# EAGLE schematic rev1 (EAGLE 9.5.2)
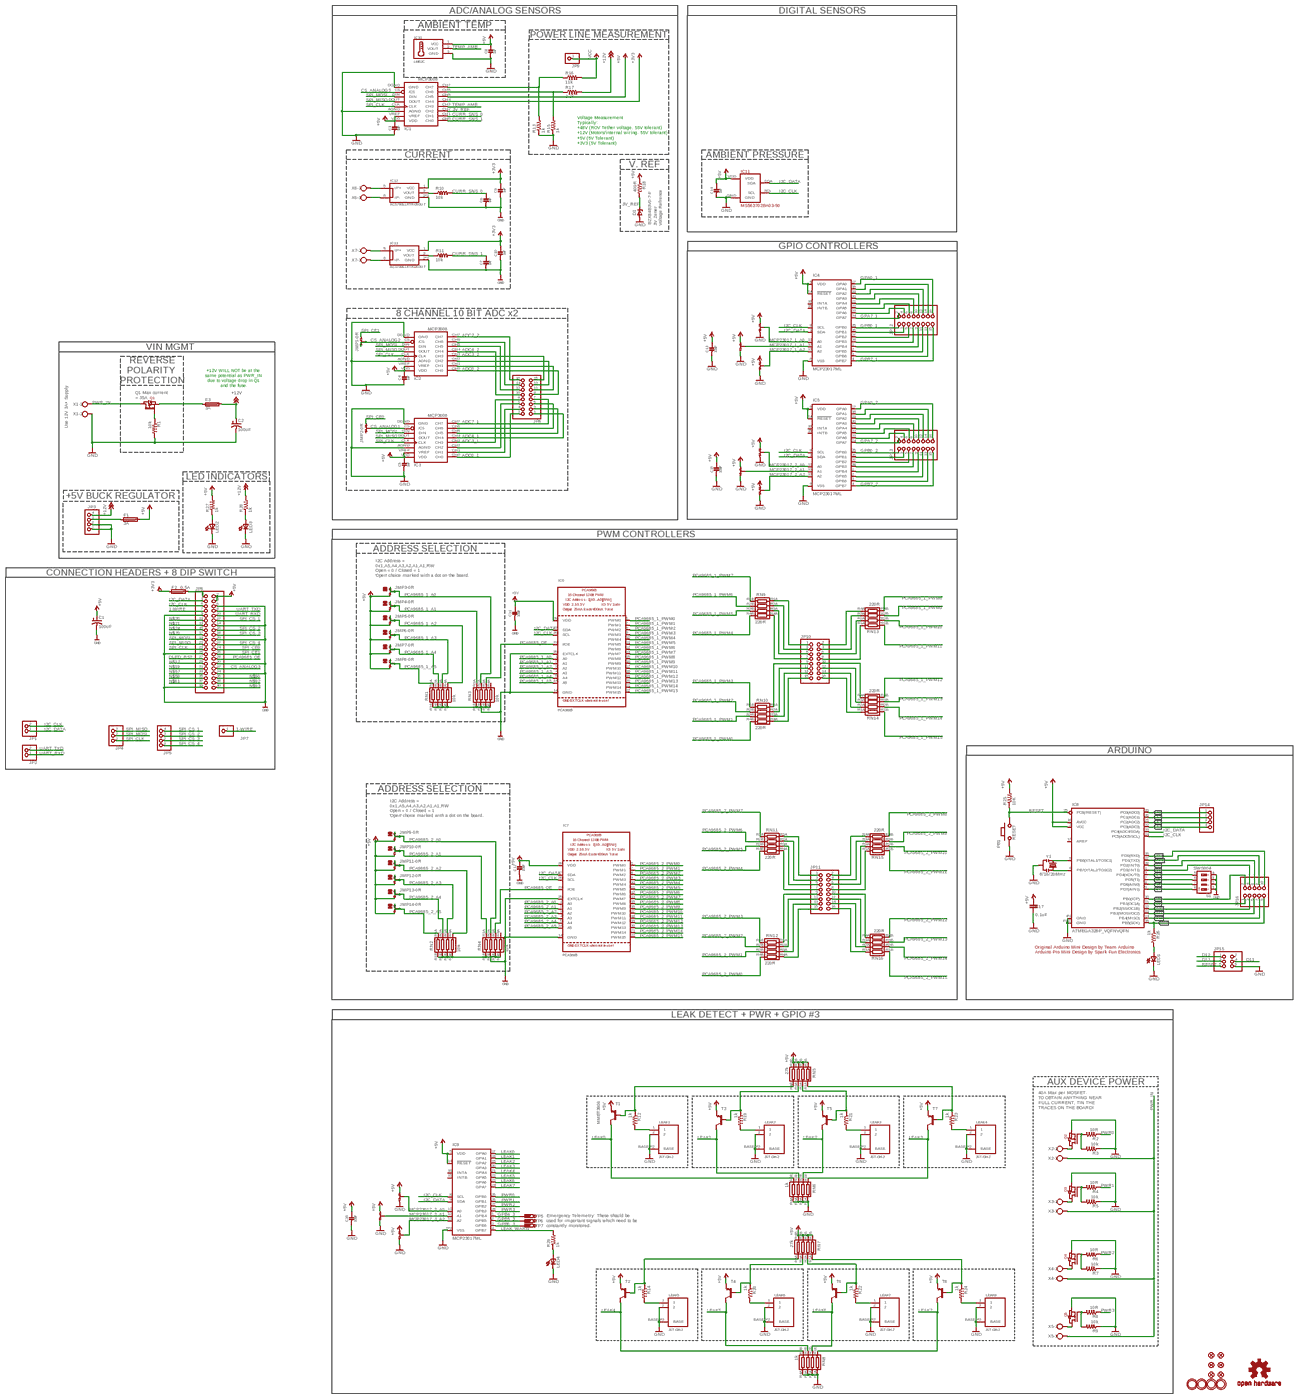
[diagram p0: schematic, sheet 1, overview]
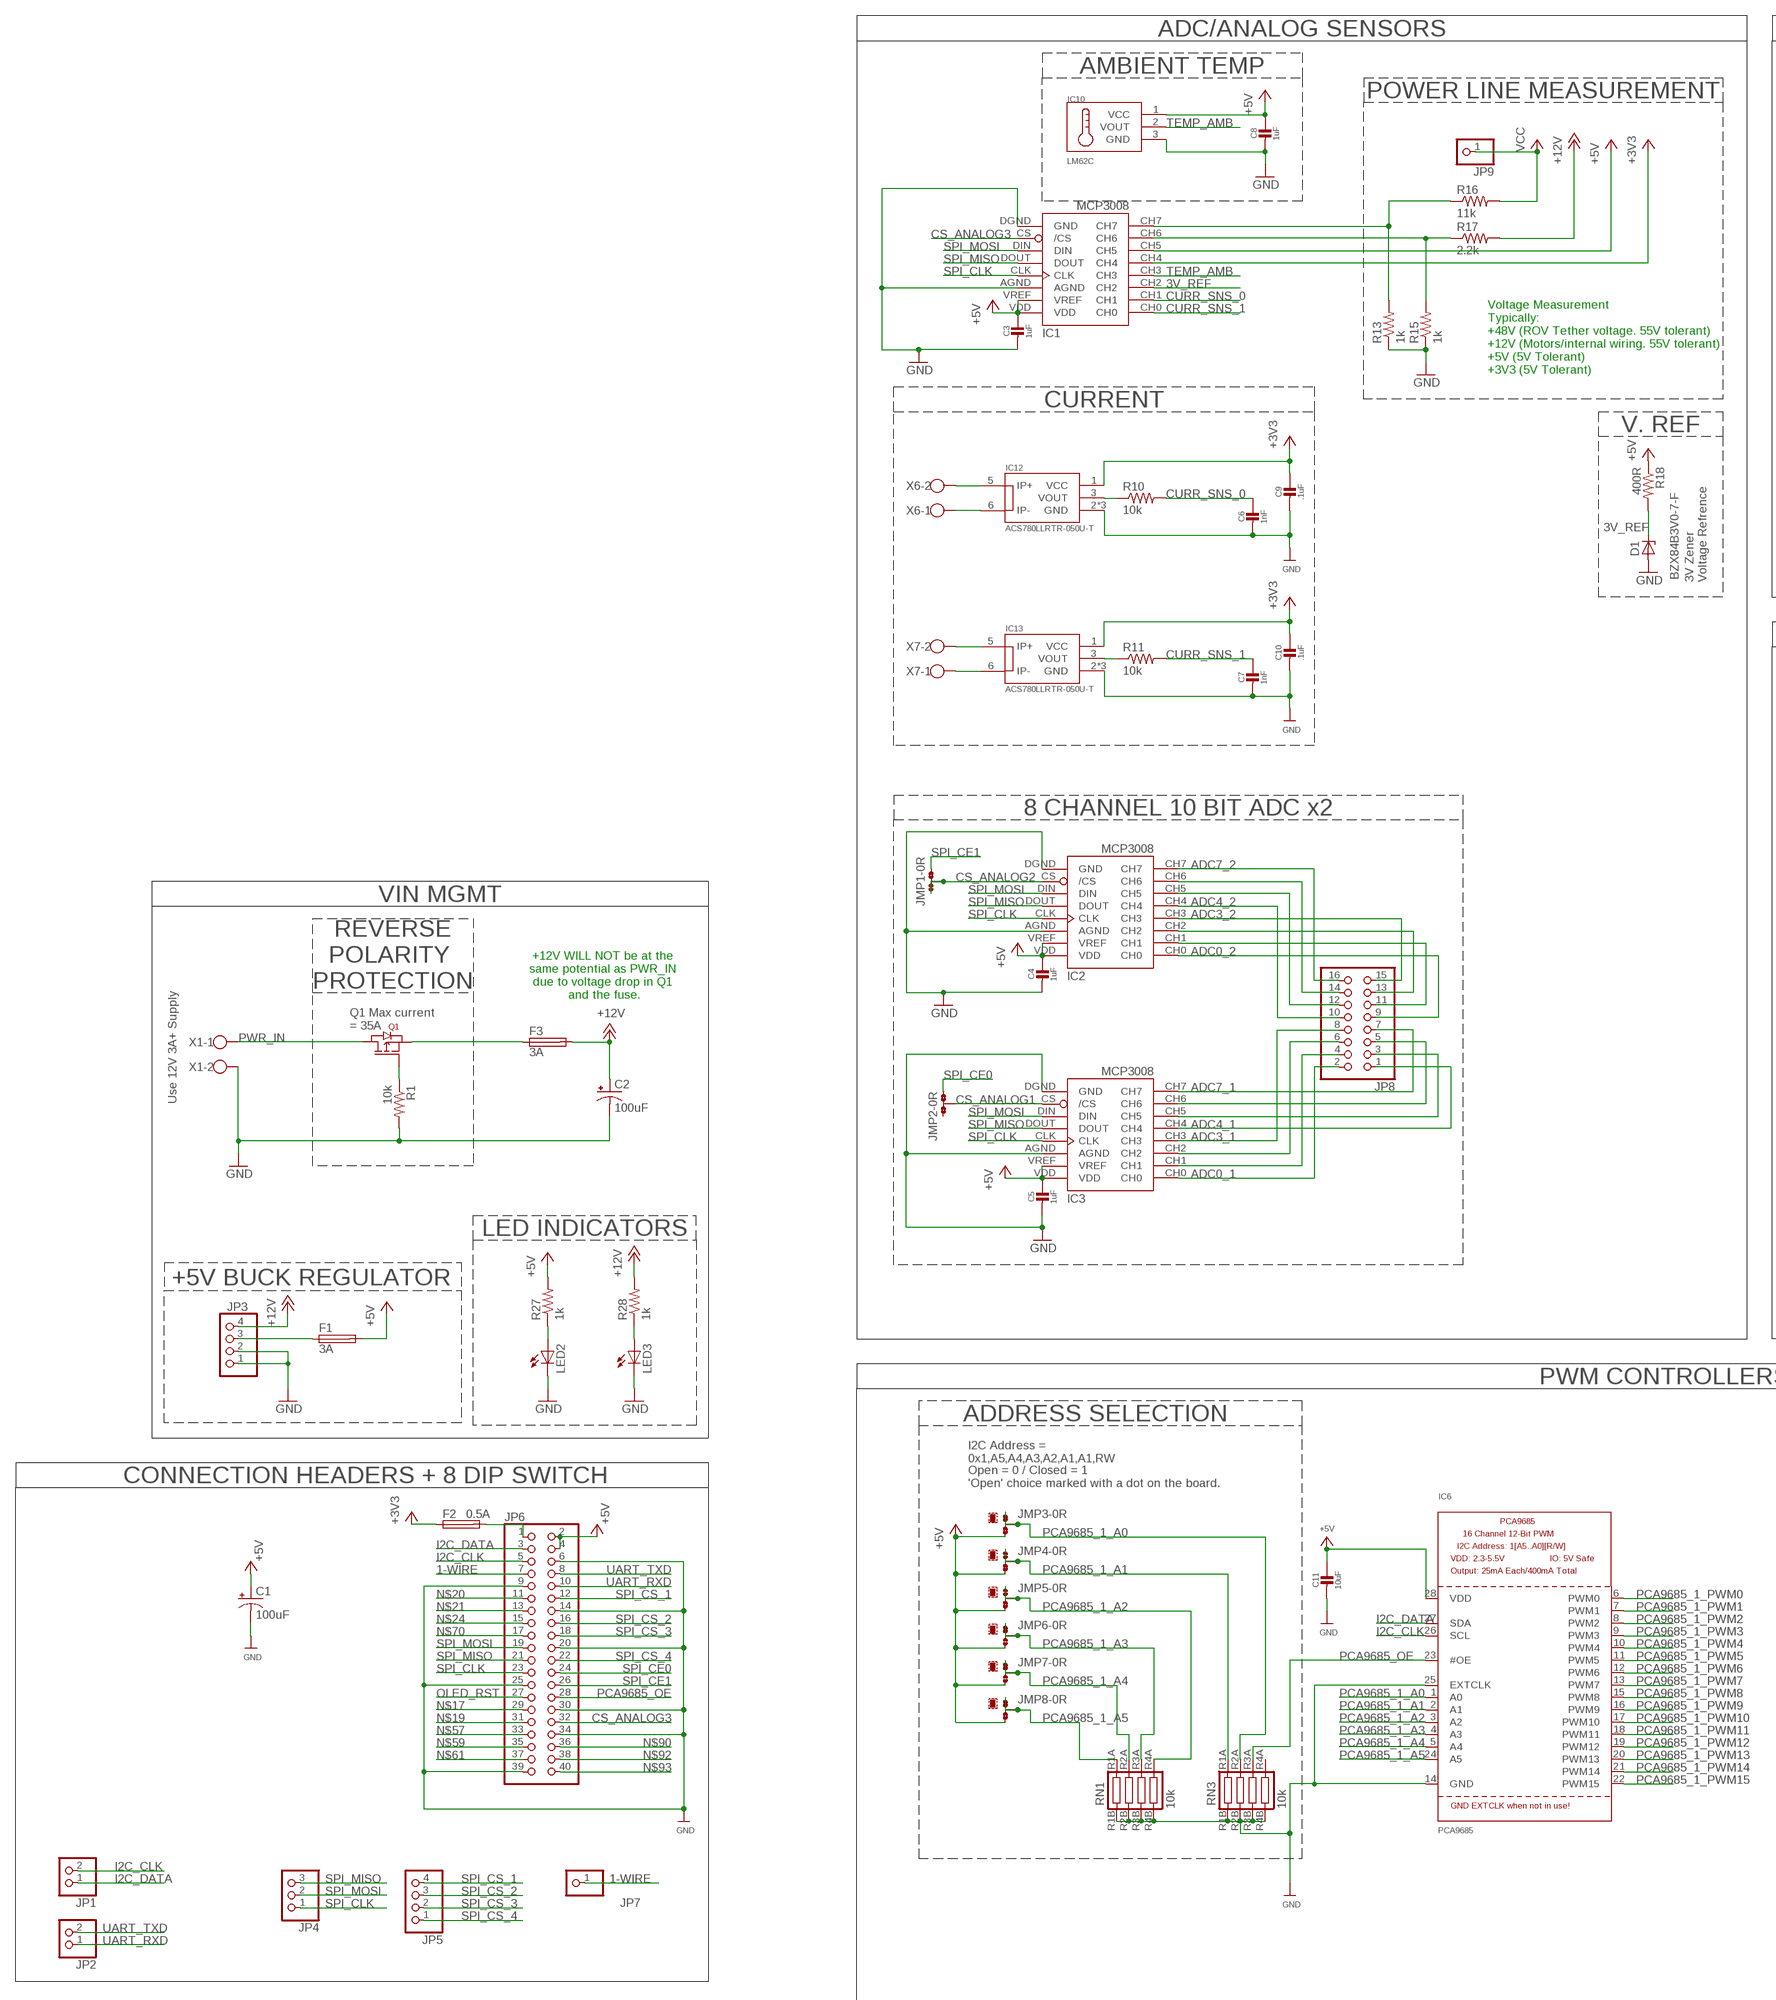
[diagram p1: schematic, sheet 1, part 1 of 4]
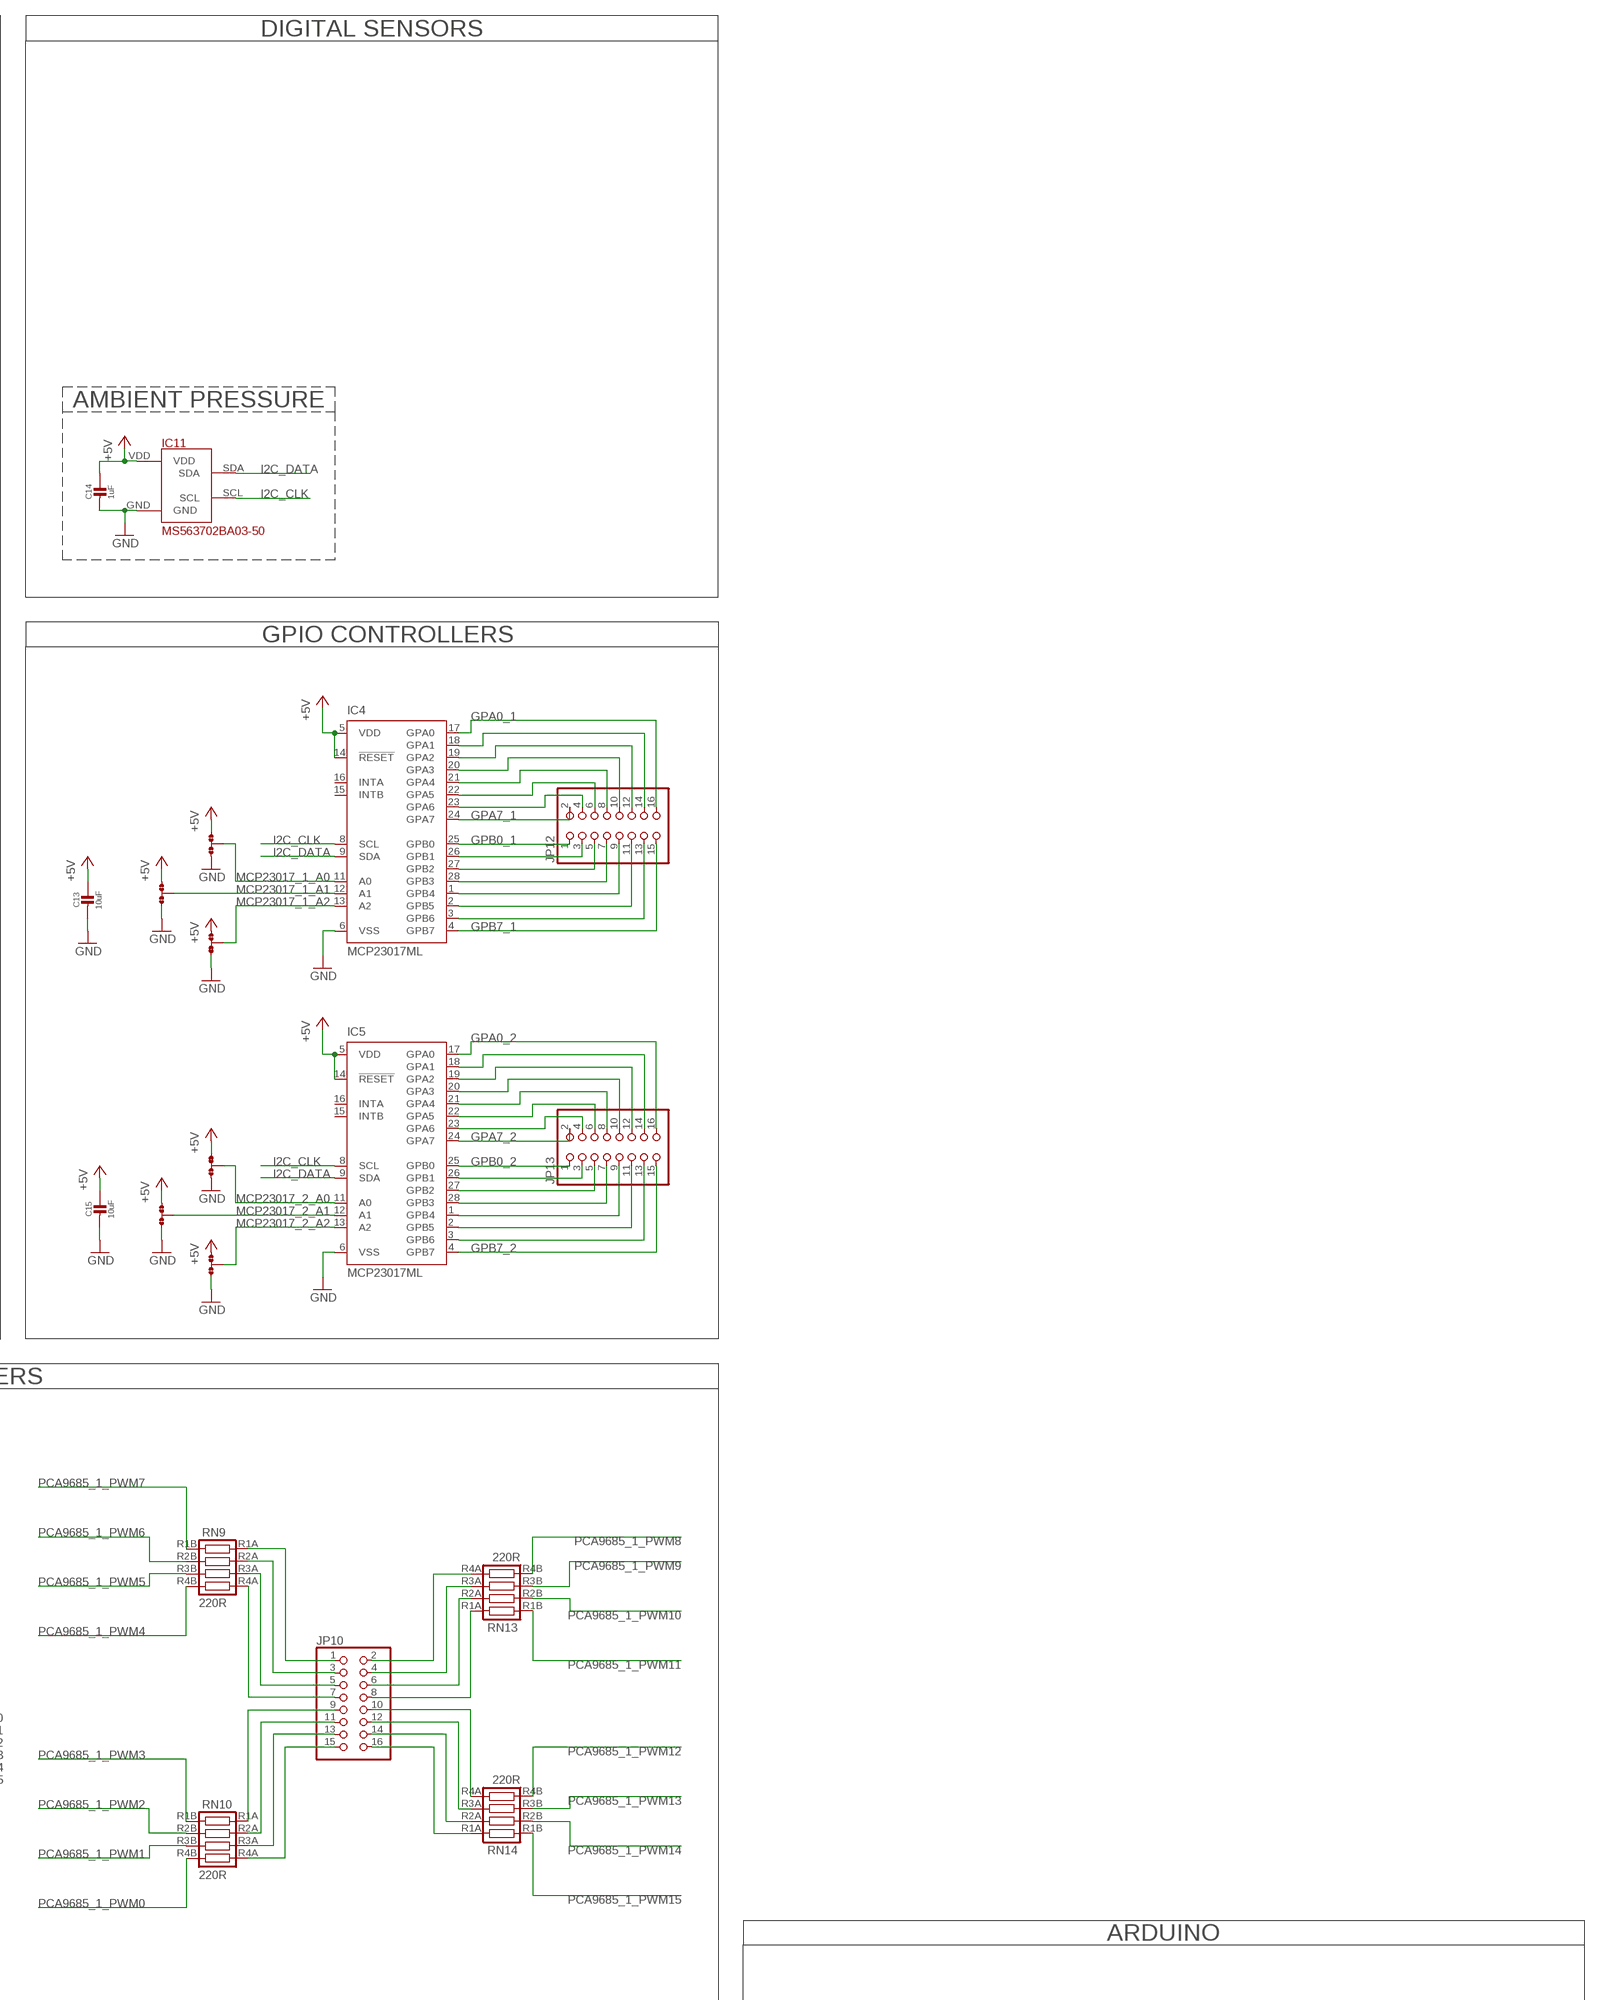
[diagram p2: schematic, sheet 1, part 2 of 4]
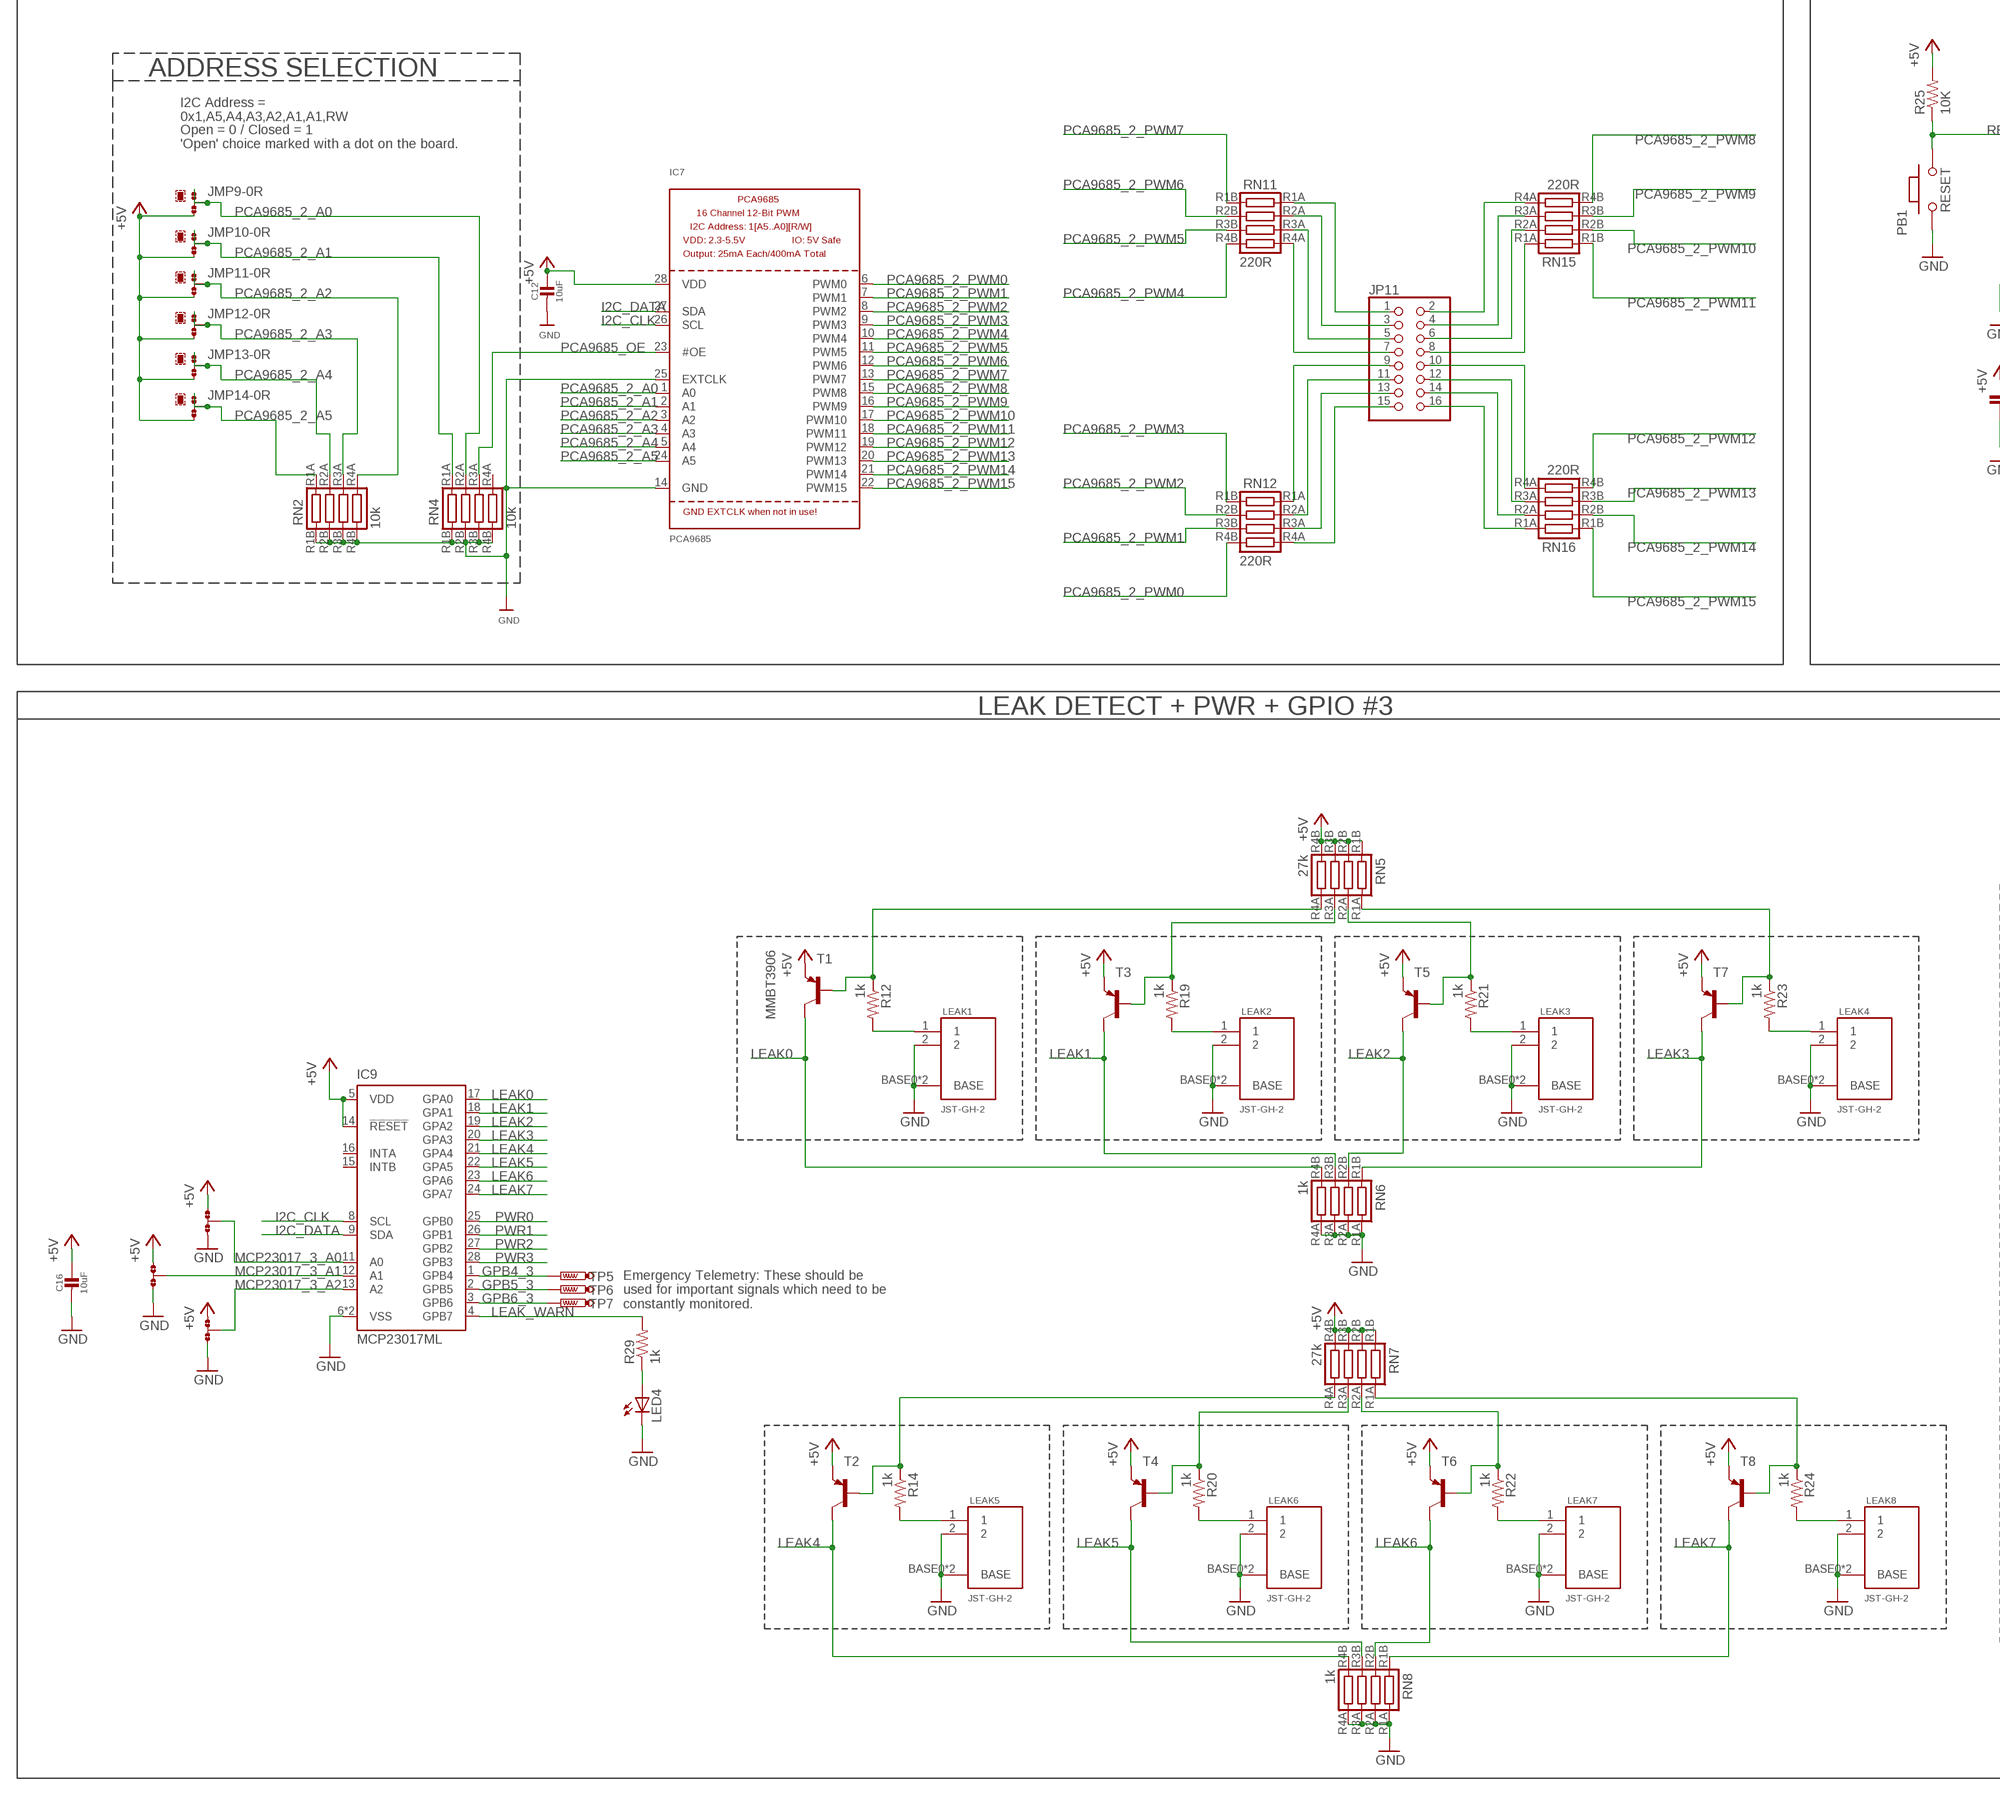
[diagram p3: schematic, sheet 1, part 3 of 4]
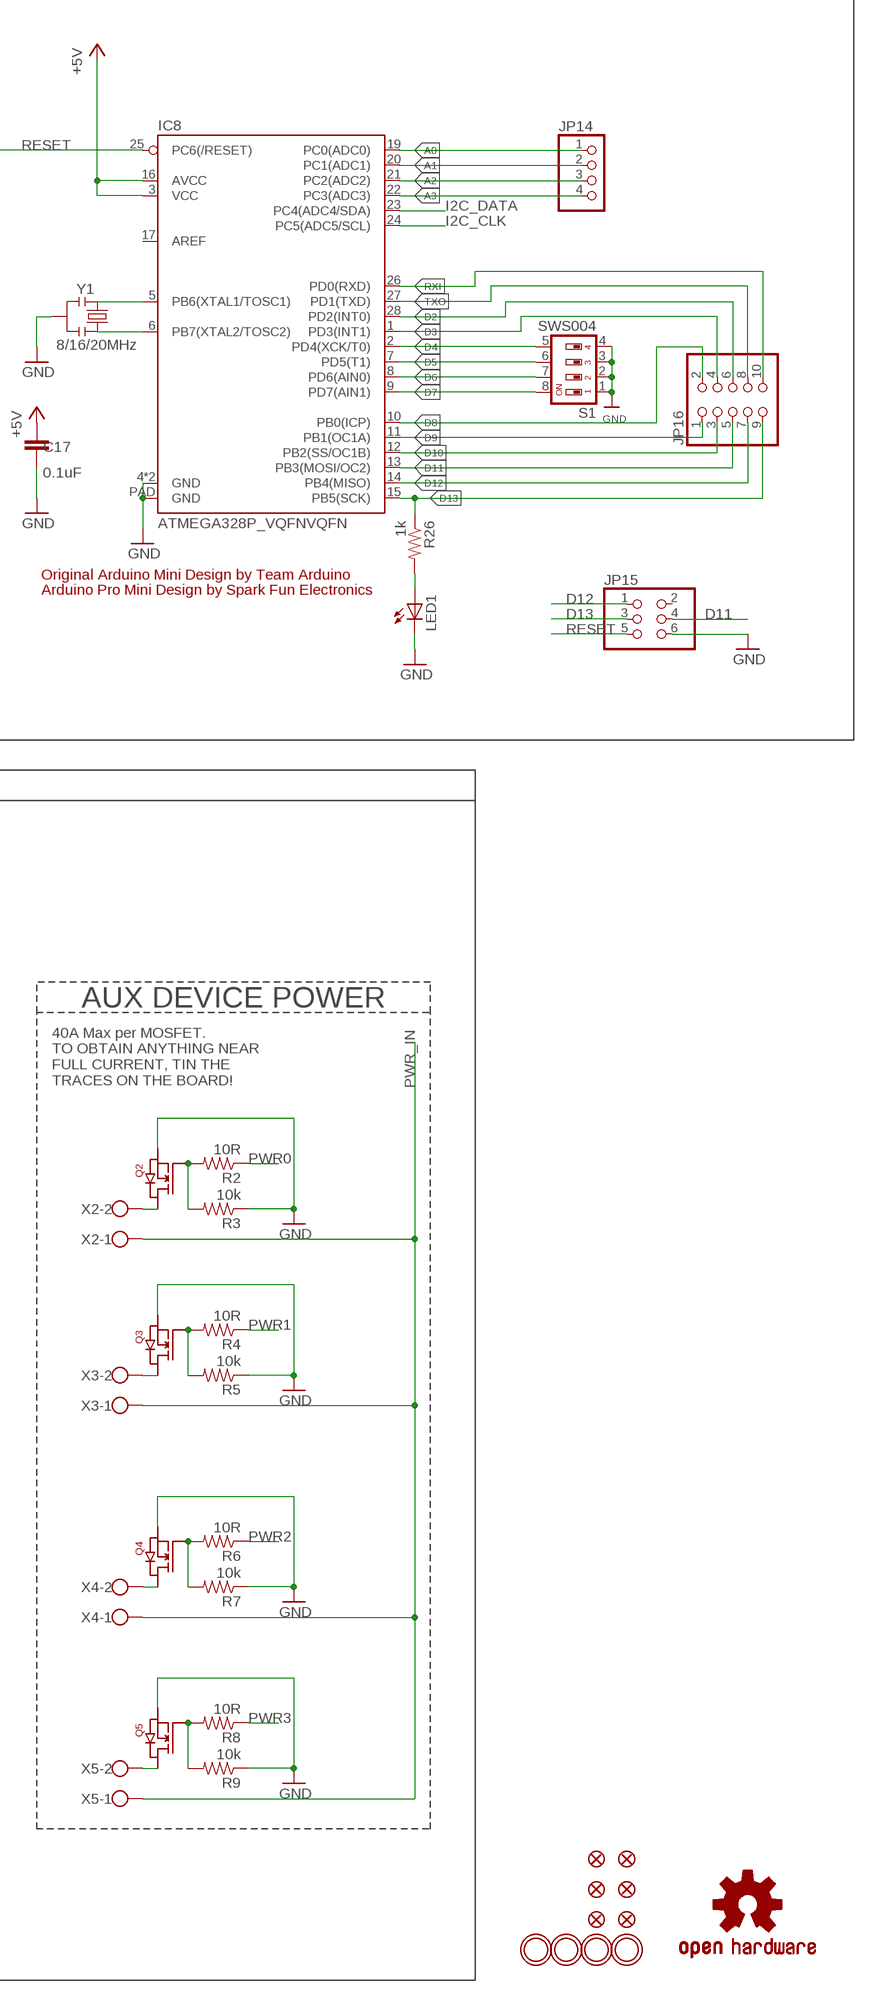
[diagram p4: schematic, sheet 1, part 4 of 4]

## Parts
1  MOUNTINGHOLE2.5  [MOUNTINGHOLE_2.5_PLATED]
2  MOUNTINGHOLE2.5  [MOUNTINGHOLE_2.5_PLATED]
3  MOUNTINGHOLE2.5  [MOUNTINGHOLE_2.5_PLATED]
4  MOUNTINGHOLE2.5  [MOUNTINGHOLE_2.5_PLATED]
5  OSHW-LOGOS  [OSHW-LOGO-S]
C1  100uF  CPOL-US153CLV-0807  [153CLV-0807]
C2  100uF  CPOL-US153CLV-0807  [153CLV-0807]
C3  1uF  CAP_CERAMIC0805-NOOUTLINE  [0805-NO]
C4  1uF  CAP_CERAMIC0805-NOOUTLINE  [0805-NO]
C5  1uF  CAP_CERAMIC0805-NOOUTLINE  [0805-NO]
C6  1nF  CAP_CERAMIC0805-NOOUTLINE  [0805-NO]
C7  1nF  CAP_CERAMIC0805-NOOUTLINE  [0805-NO]
C8  1uF  CAP_CERAMIC0805-NOOUTLINE  [0805-NO]
C9  .1uF  CAP_CERAMIC0805-NOOUTLINE  [0805-NO]
C10  .1uF  CAP_CERAMIC0805-NOOUTLINE  [0805-NO]
C11  10uF  CAP_CERAMIC0805-NOOUTLINE  [0805-NO]
C12  10uF  CAP_CERAMIC0805-NOOUTLINE  [0805-NO]
C13  10uF  CAP_CERAMIC0805-NOOUTLINE  [0805-NO]
C14  1uF  CAP_CERAMIC0805-NOOUTLINE  [0805-NO]
C15  10uF  CAP_CERAMIC0805-NOOUTLINE  [0805-NO]
C16  10uF  CAP_CERAMIC0805-NOOUTLINE  [0805-NO]
C17  0.1uF  C-EUC0805  [C0805]
D1  BZX84B3V0-7-F  ZENER-DIODESOT23  [SOT23]
F1  3A  PTC_FUSE3  [2920_(7351_METRIC)]
F2  0.5A  PTC_FUSE2  [1210_(3225METRIC)]
F3  3A  PTC_FUSE3  [2920_(7351_METRIC)]
FID1  FIDUCIAL""  [FIDUCIAL_1MM]
FID2  FIDUCIAL""  [FIDUCIAL_1MM]
FID3  FIDUCIAL""  [FIDUCIAL_1MM]
FID4  FIDUCIAL""  [FIDUCIAL_1MM]
FID5  FIDUCIAL""  [FIDUCIAL_1MM]
FID6  FIDUCIAL""  [FIDUCIAL_1MM]
IC1  U2  MCP3008  [MCP3008]
IC2  U2  MCP3008  [MCP3008]
IC3  U2  MCP3008  [MCP3008]
IC4  MCP23017ML  [QFN28-ML_6X6MM]
IC5  MCP23017ML  [QFN28-ML_6X6MM]
IC6  PCA9685  [TSSOP28]
IC7  PCA9685  [TSSOP28]
IC8  ATMEGA328P_VQFNVQFN  [VQFN-28]
IC9  MCP23017ML  [QFN28-ML_6X6MM]
IC10  LM62C  [SOT23-R]
IC11  MS563702BA03-50  PRESSURE  [MS5637]
IC12  ACS780LLRTR-050U-T  ACS781  [ACS781]
IC13  ACS780LLRTR-050U-T  ACS781  [ACS781]
JMP1  0R-JUMPC  [C0R-JMP]
JMP2  0R-JUMPC  [C0R-JMP]
JMP3  0R-JUMPC  [C0R-JMP]
JMP4  0R-JUMPC  [C0R-JMP]
JMP5  0R-JUMPC  [C0R-JMP]
JMP6  0R-JUMPC  [C0R-JMP]
JMP7  0R-JUMPC  [C0R-JMP]
JMP8  0R-JUMPC  [C0R-JMP]
JMP9  0R-JUMPC  [C0R-JMP]
JMP10  0R-JUMPC  [C0R-JMP]
JMP11  0R-JUMPC  [C0R-JMP]
JMP12  0R-JUMPC  [C0R-JMP]
JMP13  0R-JUMPC  [C0R-JMP]
JMP14  0R-JUMPC  [C0R-JMP]
JMP15  0R-JUMPC  [C0R-JMP]
JMP16  0R-JUMPC  [C0R-JMP]
JMP17  0R-JUMPC  [C0R-JMP]
JMP18  0R-JUMPC  [C0R-JMP]
JMP19  0R-JUMPC  [C0R-JMP]
JMP20  0R-JUMPC  [C0R-JMP]
JMP21  0R-JUMPC  [C0R-JMP]
JMP22  0R-JUMPC  [C0R-JMP]
JMP23  0R-JUMPC  [C0R-JMP]
JP1  PINHD-1X2  [1X02]
JP2  PINHD-1X2  [1X02]
JP3  PINHD-1X4  [1X04]
JP4  PINHD-1X3  [1X03]
JP5  PINHD-1X4  [1X04]
JP6  PINHD-2X20  [2X20]
JP7  PINHD-1X1  [1X01]
JP8  PINHD-2X8  [2X08]
JP9  PINHD-1X1  [1X01]
JP10  PINHD-2X8  [2X08]
JP11  PINHD-2X8  [2X08]
JP12  PINHD-2X8  [2X08]
JP13  PINHD-2X8  [2X08]
JP14  PINHD-1X4  [1X04]
JP15  PINHD-2X3  [2X03]
JP16  PINHD-2X5  [2X05]
LEAK1  JST-GH-2  [JST-GH]
LEAK2  JST-GH-2  [JST-GH]
LEAK3  JST-GH-2  [JST-GH]
LEAK4  JST-GH-2  [JST-GH]
LEAK5  JST-GH-2  [JST-GH]
LEAK6  JST-GH-2  [JST-GH]
LEAK7  JST-GH-2  [JST-GH]
LEAK8  JST-GH-2  [JST-GH]
LED1  LED_E  [LED_1206]
LED2  LED_E  [LED_1206]
LED3  LED_E  [LED_1206]
LED4  LED_E  [LED_1206]
PB1  RESET  0173_IT-1185AP1C-160G-G_T&R  [SMD_157SW]
Q1  1212_PFET  [POWERPACK_1212-8]
Q2  1212_NFET  [POWERPACK_1212-8]
Q3  1212_NFET  [POWERPACK_1212-8]
Q4  1212_NFET  [POWERPACK_1212-8]
Q5  1212_NFET  [POWERPACK_1212-8]
R1  10k  R-US_R0402  [R0402]
R2  10R  R-US_R0805  [R0805]
R3  10k  R-US_R0805  [R0805]
R4  10R  R-US_R0805  [R0805]
R5  10k  R-US_R0805  [R0805]
R6  10R  R-US_R0805  [R0805]
R7  10k  R-US_R0805  [R0805]
R8  10R  R-US_R0805  [R0805]
R9  10k  R-US_R0805  [R0805]
R10  10k  R-US_R0402  [R0402]
R11  10k  R-US_R0402  [R0402]
R12  1k  R-US_R0402  [R0402]
R13  1k  R-US_R0402  [R0402]
R14  1k  R-US_R0402  [R0402]
R15  1k  R-US_R0402  [R0402]
R16  11k  R-US_R0402  [R0402]
R17  2.2k  R-US_R0402  [R0402]
R18  400R  R-US_R0402  [R0402]
R19  1k  R-US_R0402  [R0402]
R20  1k  R-US_R0402  [R0402]
R21  1k  R-US_R0402  [R0402]
R22  1k  R-US_R0402  [R0402]
R23  1k  R-US_R0402  [R0402]
R24  1k  R-US_R0402  [R0402]
R25  10K  R-US_R0805  [R0805]
R26  1k  R-US_R0805  [R0805]
R27  1k  R-US_R0805  [R0805]
R28  1k  R-US_R0805  [R0805]
R29  1k  R-US_R0805  [R0805]
RN1  10k  RN4_0804  [0804_RN]
RN2  10k  RN4_0804  [0804_RN]
RN3  10k  RN4_0804  [0804_RN]
RN4  10k  RN4_0804  [0804_RN]
RN5  27k  RN4_0804  [0804_RN]
RN6  1k  RN4_0804  [0804_RN]
RN7  27k  RN4_0804  [0804_RN]
RN8  1k  RN4_0804  [0804_RN]
RN9  220R  RN4_0804  [0804_RN]
RN10  220R  RN4_0804  [0804_RN]
RN11  220R  RN4_0804  [0804_RN]
RN12  220R  RN4_0804  [0804_RN]
RN13  220R  RN4_0804  [0804_RN]
RN14  220R  RN4_0804  [0804_RN]
RN15  220R  RN4_0804  [0804_RN]
RN16  220R  RN4_0804  [0804_RN]
S1  SWS004  [SMS-004]
T1  MMBT3906  BC807-40-PNP-SOT23-BEC  [SOT23-BEC]
T2  BC807-40-PNP-SOT23-BEC  [SOT23-BEC]
T3  BC807-40-PNP-SOT23-BEC  [SOT23-BEC]
T4  BC807-40-PNP-SOT23-BEC  [SOT23-BEC]
T5  BC807-40-PNP-SOT23-BEC  [SOT23-BEC]
T6  BC807-40-PNP-SOT23-BEC  [SOT23-BEC]
T7  BC807-40-PNP-SOT23-BEC  [SOT23-BEC]
T8  BC807-40-PNP-SOT23-BEC  [SOT23-BEC]
TP5  PTR1TP06R  [TP06R]
TP6  PTR1TP06R  [TP06R]
TP7  PTR1TP06R  [TP06R]
X1  W237-102  [W237-102]
X2  W237-102  [W237-102]
X3  W237-102  [W237-102]
X4  W237-102  [W237-102]
X5  W237-102  [W237-102]
X6  W237-102  [W237-102]
X7  W237-102  [W237-102]
Y1  8/16/20MHz  RESONATOR1:1  [RESONATOR-SMD-1:1]

## Nets
1-WIRE: JP6.7 JP7.1
3V_REF: D1.3(C) IC1.CH2 R18.2
+3V3: C9.1 C10.1 F2.1 IC1.CH4 IC12.1(VCC) IC13.1(VCC)
+5V: C1.+ C3.1 C4.1 C5.1 C8.1 C11.1 C12.1 C13.1 C14.1 C15.1 C16.1 C17.2 F1.2 IC1.CH5 IC1.VDD IC1.VREF IC2.VDD IC2.VREF IC3.VDD IC3.VREF IC4.5(VDD) IC4.14(!RESET) IC5.5(VDD) IC5.14(!RESET) IC6.28(VDD) IC7.28(VDD) IC8.3(VCC) IC8.16(AVCC) IC9.5(VDD) IC9.14(!RESET) IC10.1(VCC) IC11.VDD JMP3.3 JMP4.3 JMP5.3 JMP6.3 JMP7.3 JMP8.3 JMP9.3 JMP10.3 JMP11.3 JMP12.3 JMP13.3 JMP14.3 JMP15.1 JMP16.1 JMP17.1 JMP18.1 JMP19.1 JMP20.1 JMP21.1 JMP22.1 JMP23.1 JP6.2 JP6.4 R18.1 R25.2 R27.2 RN5.R1B RN5.R2B RN5.R3B RN5.R4B RN7.R1B RN7.R2B RN7.R3B RN7.R4B T1.E T2.E T3.E T4.E T5.E T6.E T7.E T8.E
+12V: C2.+ F3.2 JP3.4 R17.2 R28.2
A0: IC8.19(PC0(ADC0)) JP14.1
A1: IC8.20(PC1(ADC1)) JP14.2
A2: IC8.21(PC2(ADC2)) JP14.3
A3: IC8.22(PC3(ADC3)) JP14.4
ADC0_1: IC3.CH0 JP8.2
ADC0_2: IC2.CH0 JP8.9
ADC3_1: IC3.CH3 JP8.8
ADC3_2: IC2.CH3 JP8.15
ADC4_1: IC3.CH4 JP8.1
ADC4_2: IC2.CH4 JP8.10
ADC7_1: IC3.CH7 JP8.7
ADC7_2: IC2.CH7 JP8.16
CS_ANALOG1: IC3.CS(/CS) JMP2.2
CS_ANALOG2: IC2.CS(/CS) JMP1.2 JMP1.3
CS_ANALOG3: IC1.CS(/CS) JP6.32
CURR_SNS_0: C6.1 IC1.CH1 R10.2
CURR_SNS_1: C7.1 IC1.CH0 R11.2
D2: IC8.28(PD2(INT0)) JP16.6
D3: IC8.1(PD3(INT1)) JP16.4
D4: IC8.2(PD4(XCK/T0)) S1.5
D5: IC8.7(PD5(T1)) S1.6
D6: IC8.8(PD6(AIN0)) S1.7
D7: IC8.9(PD7(AIN1)) S1.8
D8: IC8.10(PB0(ICP)) JP16.2
D9: IC8.11(PB1(OC1A)) JP16.1
D10: IC8.12(PB2(SS/OC1B)) JP16.3
D11: IC8.13(PB3(MOSI/OC2)) JP15.4 JP16.5
D12: IC8.14(PB4(MISO)) JP15.1 JP16.7
D13: IC8.15(PB5(SCK)) JP15.3 JP16.9 R26.1
GND: C1.- C2.- C3.2 C4.2 C5.2 C6.2 C7.2 C8.2 C9.2 C10.2 C11.2 C12.2 C13.2 C14.2 C15.2 C16.2 C17.1 D1.1(A) IC1.AGND IC1.DGND(GND) IC2.AGND IC2.DGND(GND) IC3.AGND IC3.DGND(GND) IC4.6(VSS) IC5.6(VSS) IC6.14(GND) IC6.25(EXTCLK) IC7.14(GND) IC7.25(EXTCLK) IC8.4(GND) IC8.18(GND) IC8.PAD(GND) IC9.6(VSS) IC9.EXP(VSS) IC10.3(GND) IC11.GND IC12.2(GND) IC12.4(GND) IC12.7(GND) IC13.2(GND) IC13.4(GND) IC13.7(GND) JMP15.3 JMP16.3 JMP17.3 JMP18.3 JMP19.3 JMP20.3 JMP21.3 JMP22.3 JMP23.3 JP3.1 JP3.2 JP6.6 JP6.9 JP6.14 JP6.20 JP6.25 JP6.30 JP6.34 JP6.39 JP15.6 LEAK1.2 LEAK1.BASE0(BASE) LEAK1.BASE1(BASE) LEAK2.2 LEAK2.BASE0(BASE) LEAK2.BASE1(BASE) LEAK3.2 LEAK3.BASE0(BASE) LEAK3.BASE1(BASE) LEAK4.2 LEAK4.BASE0(BASE) LEAK4.BASE1(BASE) LEAK5.2 LEAK5.BASE0(BASE) LEAK5.BASE1(BASE) LEAK6.2 LEAK6.BASE0(BASE) LEAK6.BASE1(BASE) LEAK7.2 LEAK7.BASE0(BASE) LEAK7.BASE1(BASE) LEAK8.2 LEAK8.BASE0(BASE) LEAK8.BASE1(BASE) LED1.C LED2.C LED3.C LED4.C PB1.1 Q2.S1(SOURCE) Q2.S2(SOURCE) Q2.S3(SOURCE) Q3.S1(SOURCE) Q3.S2(SOURCE) Q3.S3(SOURCE) Q4.S1(SOURCE) Q4.S2(SOURCE) Q4.S3(SOURCE) Q5.S1(SOURCE) Q5.S2(SOURCE) Q5.S3(SOURCE) R1.2 R3.1 R5.1 R7.1 R9.1 R13.1 R15.1 RN1.R1B RN1.R2B RN1.R3B RN1.R4B RN2.R1B RN2.R2B RN2.R3B RN2.R4B RN3.R1B RN3.R2B RN3.R3B RN3.R4B RN4.R1B RN4.R2B RN4.R3B RN4.R4B RN6.R1A(1A) RN6.R2A(2A) RN6.R3A(3A) RN6.R4A(4A) RN8.R1A(1A) RN8.R2A(2A) RN8.R3A(3A) RN8.R4A(4A) S1.1 S1.2 S1.3 S1.4 X1.2 Y1.2
GPA0_1: IC4.17(GPA0) JP12.16
GPA0_2: IC5.17(GPA0) JP13.16
GPA7_1: IC4.24(GPA7) JP12.2
GPA7_2: IC5.24(GPA7) JP13.2
GPB0_1: IC4.25(GPB0) JP12.1
GPB0_2: IC5.25(GPB0) JP13.1
GPB4_3: IC9.1(GPB4) TP5.TP
GPB5_3: IC9.2(GPB5) TP6.TP
GPB6_3: IC9.3(GPB6) TP7.TP
GPB7_1: IC4.4(GPB7) JP12.15
GPB7_2: IC5.4(GPB7) JP13.15
I2C_CLK: IC4.8(SCL) IC5.8(SCL) IC6.26(SCL) IC7.26(SCL) IC8.24(PC5(ADC5/SCL)) IC9.8(SCL) IC11.SCL JP1.2 JP6.5
I2C_DATA: IC4.9(SDA) IC5.9(SDA) IC6.27(SDA) IC7.27(SDA) IC8.23(PC4(ADC4/SDA)) IC9.9(SDA) IC11.SDA JP1.1 JP6.3
LEAK0: IC9.17(GPA0) RN6.R4B T1.C
LEAK1: IC9.18(GPA1) RN6.R3B T3.C
LEAK2: IC9.19(GPA2) RN6.R2B T5.C
LEAK3: IC9.20(GPA3) RN6.R1B T7.C
LEAK4: IC9.21(GPA4) RN8.R4B T2.C
LEAK5: IC9.22(GPA5) RN8.R3B T4.C
LEAK6: IC9.23(GPA6) RN8.R2B T6.C
LEAK7: IC9.24(GPA7) RN8.R1B T8.C
LEAK_WARN: IC9.4(GPB7) R29.2
MCP1_GPA1: IC4.18(GPA1) JP12.14
MCP1_GPA2: IC4.19(GPA2) JP12.12
MCP1_GPA7: IC4.23(GPA6) JP12.4
MCP23017_1_A0: IC4.11(A0) JMP17.2
MCP23017_1_A1: IC4.12(A1) JMP15.2
MCP23017_1_A2: IC4.13(A2) JMP18.2
MCP23017_2_A0: IC5.11(A0) JMP19.2
MCP23017_2_A1: IC5.12(A1) JMP16.2
MCP23017_2_A2: IC5.13(A2) JMP20.2
MCP23017_3_A0: IC9.11(A0) JMP22.2
MCP23017_3_A1: IC9.12(A1) JMP21.2
MCP23017_3_A2: IC9.13(A2) JMP23.2
N$1: Q2.G(GATE) R2.2 R3.2
N$2: JP11.14 RN16.R2A(2A)
N$3: Q1.G(GATE) R1.1
N$4: LED2.A R27.1
N$5: LEAK1.1 R12.2
N$6: LEAK2.1 R19.2
N$7: LED3.A R28.1
N$8: IC2.CH6 JP8.14
N$9: LED1.A R26.2
N$10: IC2.CH5 JP8.12
N$11: IC1.CH6 R15.2 R17.1
N$12: IC8.6(PB7(XTAL2/TOSC2)) Y1.3
N$13: R21.1 RN5.R2A(2A) T5.B
N$14: IC8.5(PB6(XTAL1/TOSC1)) Y1.1
N$15: F3.1 Q1.S1(SOURCE) Q1.S2(SOURCE) Q1.S3(SOURCE)
N$16: LEAK3.1 R21.2
N$17: JP6.29
N$18: LED4.A R29.1
N$19: JP6.31
N$20: JP6.11
N$21: JP6.13
N$22: IC3.CH6 JP8.5
N$23: IC3.CH5 JP8.3
N$24: JP6.15
N$25: JP11.11 RN12.R2A(2A)
N$26: JP10.7 RN9.R4A(4A)
N$27: JP10.9 RN10.R1A(1A)
N$28: JP10.11 RN10.R2A(2A)
N$29: JP10.13 RN10.R3A(3A)
N$30: JP10.15 RN10.R4A(4A)
N$31: JP10.5 RN9.R3A(3A)
N$32: JP10.3 RN9.R2A(2A)
N$33: JP10.1 RN9.R1A(1A)
N$34: JP10.10 RN14.R4A(4A)
N$35: JP10.12 RN14.R3A(3A)
N$36: JP10.14 RN14.R2A(2A)
N$37: JP10.16 RN14.R1A(1A)
N$38: JP10.8 RN13.R1A(1A)
N$39: JP10.6 RN13.R2A(2A)
N$40: JP10.4 RN13.R3A(3A)
N$41: JP10.2 RN13.R4A(4A)
N$42: JP11.13 RN12.R3A(3A)
N$43: JP11.15 RN12.R4A(4A)
N$44: JP11.7 RN11.R4A(4A)
N$45: JP11.9 RN12.R1A(1A)
N$46: JP11.5 RN11.R3A(3A)
N$47: JP11.3 RN11.R2A(2A)
N$48: JP11.1 RN11.R1A(1A)
N$49: JP11.2 RN15.R4A(4A)
N$50: JP11.4 RN15.R3A(3A)
N$51: JP11.6 RN15.R2A(2A)
N$52: JP11.10 RN16.R4A(4A)
N$53: JP11.8 RN15.R1A(1A)
N$54: JP11.12 RN16.R3A(3A)
N$55: Q2.D0(DRAIN) Q2.D1(DRAIN) Q2.D2(DRAIN) Q2.D3(DRAIN) Q2.D4(DRAIN) X2.2
N$56: JP11.16 RN16.R1A(1A)
N$57: JP6.33
N$58: Q3.G(GATE) R4.2 R5.2
N$59: JP6.35
N$60: Q3.D0(DRAIN) Q3.D1(DRAIN) Q3.D2(DRAIN) Q3.D3(DRAIN) Q3.D4(DRAIN) X3.2
N$61: JP6.37
N$62: Q4.D0(DRAIN) Q4.D1(DRAIN) Q4.D2(DRAIN) Q4.D3(DRAIN) Q4.D4(DRAIN) X4.2
N$63: Q4.G(GATE) R6.2 R7.2
N$64: Q5.D0(DRAIN) Q5.D1(DRAIN) Q5.D2(DRAIN) Q5.D3(DRAIN) Q5.D4(DRAIN) X5.2
N$65: IC13.6(IP-) X7.1
N$66: F1.1 JP3.3
N$67: IC3.CH2 JP8.6
N$68: IC3.CH1 JP8.4
N$69: F2.2 JP6.1
N$70: JP6.17
N$71: IC2.CH2 JP8.13
N$73: IC2.CH1 JP8.11
N$75: R12.1 RN5.R4A(4A) T1.B
N$76: R14.1 RN7.R4A(4A) T2.B
N$77: IC5.26(GPB1) JP13.3
N$78: IC5.27(GPB2) JP13.5
N$79: R19.1 RN5.R3A(3A) T3.B
N$80: IC5.28(GPB3) JP13.7
N$81: IC5.1(GPB4) JP13.9
N$82: IC5.2(GPB5) JP13.11
N$83: Q5.G(GATE) R8.2 R9.2
N$85: LEAK4.1 R23.2
N$86: R23.1 RN5.R1A(1A) T7.B
N$87: LEAK5.1 R14.2
N$89: LEAK6.1 R20.2
N$90: JP6.36
N$91: R20.1 RN7.R3A(3A) T4.B
N$92: JP6.38
N$93: JP6.40
N$94: IC5.3(GPB6) JP13.13
N$95: IC12.5(IP+) X6.2
N$96: IC12.6(IP-) X6.1
N$97: IC5.23(GPA6) JP13.4
N$98: IC5.22(GPA5) JP13.6
N$99: IC5.21(GPA4) JP13.8
N$100: IC5.20(GPA3) JP13.10
N$101: IC5.19(GPA2) JP13.12
N$102: IC5.18(GPA1) JP13.14
N$103: IC13.5(IP+) X7.2
N$104: IC13.3(VOUT) R11.1
N$105: IC4.26(GPB1) JP12.3
N$106: IC4.27(GPB2) JP12.5
N$107: IC4.28(GPB3) JP12.7
N$108: IC4.1(GPB4) JP12.9
N$109: IC4.2(GPB5) JP12.11
N$110: IC4.3(GPB6) JP12.13
N$111: LEAK7.1 R22.2
N$112: IC12.3(VOUT) R10.1
N$113: R22.1 RN7.R2A(2A) T6.B
N$114: IC4.22(GPA5) JP12.6
N$115: IC4.21(GPA4) JP12.8
N$116: IC4.20(GPA3) JP12.10
N$117: LEAK8.1 R24.2
N$118: R24.1 RN7.R1A(1A) T8.B
OLED_RST: JP6.27
PCA9685_1_A0: IC6.1(A0) JMP3.1 JMP3.2 RN3.R2A(2A)
PCA9685_1_A1: IC6.2(A1) JMP4.1 JMP4.2 RN3.R1A(1A)
PCA9685_1_A2: IC6.3(A2) JMP5.1 JMP5.2 RN1.R4A(4A)
PCA9685_1_A3: IC6.4(A3) JMP6.1 JMP6.2 RN1.R3A(3A)
PCA9685_1_A4: IC6.5(A4) JMP7.1 JMP7.2 RN1.R2A(2A)
PCA9685_1_A5: IC6.24(A5) JMP8.1 JMP8.2 RN1.R1A(1A)
PCA9685_1_PWM0: IC6.6(PWM0) RN10.R4B
PCA9685_1_PWM1: IC6.7(PWM1) RN10.R3B
PCA9685_1_PWM2: IC6.8(PWM2) RN10.R2B
PCA9685_1_PWM3: IC6.9(PWM3) RN10.R1B
PCA9685_1_PWM4: IC6.10(PWM4) RN9.R4B
PCA9685_1_PWM5: IC6.11(PWM5) RN9.R3B
PCA9685_1_PWM6: IC6.12(PWM6) RN9.R2B
PCA9685_1_PWM7: IC6.13(PWM7) RN9.R1B
PCA9685_1_PWM8: IC6.15(PWM8) RN13.R4B
PCA9685_1_PWM9: IC6.16(PWM9) RN13.R3B
PCA9685_1_PWM10: IC6.17(PWM10) RN13.R2B
PCA9685_1_PWM11: IC6.18(PWM11) RN13.R1B
PCA9685_1_PWM12: IC6.19(PWM12) RN14.R4B
PCA9685_1_PWM13: IC6.20(PWM13) RN14.R3B
PCA9685_1_PWM14: IC6.21(PWM14) RN14.R2B
PCA9685_1_PWM15: IC6.22(PWM15) RN14.R1B
PCA9685_2_A0: IC7.1(A0) JMP9.1 JMP9.2 RN4.R2A(2A)
PCA9685_2_A1: IC7.2(A1) JMP10.1 JMP10.2 RN4.R1A(1A)
PCA9685_2_A2: IC7.3(A2) JMP11.1 JMP11.2 RN2.R4A(4A)
PCA9685_2_A3: IC7.4(A3) JMP12.1 JMP12.2 RN2.R3A(3A)
PCA9685_2_A4: IC7.5(A4) JMP13.1 JMP13.2 RN2.R2A(2A)
PCA9685_2_A5: IC7.24(A5) JMP14.1 JMP14.2 RN2.R1A(1A)
PCA9685_2_PWM0: IC7.6(PWM0) RN12.R4B
PCA9685_2_PWM1: IC7.7(PWM1) RN12.R3B
PCA9685_2_PWM2: IC7.8(PWM2) RN12.R2B
PCA9685_2_PWM3: IC7.9(PWM3) RN12.R1B
PCA9685_2_PWM4: IC7.10(PWM4) RN11.R4B
PCA9685_2_PWM5: IC7.11(PWM5) RN11.R3B
PCA9685_2_PWM6: IC7.12(PWM6) RN11.R2B
PCA9685_2_PWM7: IC7.13(PWM7) RN11.R1B
PCA9685_2_PWM8: IC7.15(PWM8) RN15.R4B
PCA9685_2_PWM9: IC7.16(PWM9) RN15.R3B
PCA9685_2_PWM10: IC7.17(PWM10) RN15.R2B
PCA9685_2_PWM11: IC7.18(PWM11) RN15.R1B
PCA9685_2_PWM12: IC7.19(PWM12) RN16.R4B
PCA9685_2_PWM13: IC7.20(PWM13) RN16.R3B
PCA9685_2_PWM14: IC7.21(PWM14) RN16.R2B
PCA9685_2_PWM15: IC7.22(PWM15) RN16.R1B
PCA9685_OE: IC6.23(#OE) IC7.23(#OE) JP6.28 RN3.R3A(3A) RN4.R3A(3A)
PWR0: IC9.25(GPB0) R2.1
PWR1: IC9.26(GPB1) R4.1
PWR2: IC9.27(GPB2) R6.1
PWR3: IC9.28(GPB3) R8.1
PWR_IN: Q1.D0(DRAIN) Q1.D1(DRAIN) Q1.D2(DRAIN) Q1.D3(DRAIN) Q1.D4(DRAIN) X1.1 X2.1 X3.1 X4.1 X5.1
RESET: IC8.25(PC6(/RESET)) JP15.5 PB1.2 R25.1
RXI: IC8.26(PD0(RXD)) JP16.10
SPI_CE0: JMP2.1 JP6.24
SPI_CE1: JMP1.1 JP6.26
SPI_CLK: IC1.CLK IC2.CLK IC3.CLK JP4.1 JP6.23
SPI_CS_1: JP5.4 JP6.12
SPI_CS_2: JP5.3 JP6.16
SPI_CS_3: JP5.2 JP6.18
SPI_CS_4: JP5.1 JP6.22
SPI_MISO: IC1.DOUT IC2.DOUT IC3.DOUT JP4.3 JP6.21
SPI_MOSI: IC1.DIN IC2.DIN IC3.DIN JP4.2 JP6.19
TEMP_AMB: IC1.CH3 IC10.2(VOUT)
TXO: IC8.27(PD1(TXD)) JP16.8
UART_RXD: JP2.1 JP6.10
UART_TXD: JP2.2 JP6.8
VBAT_ADC: IC1.CH7 R13.2 R16.1
VCC: JP9.1 R16.2
Unconnected: IC4.15(INTB) IC4.16(INTA) IC5.15(INTB) IC5.16(INTA) IC8.17(AREF) IC9.15(INTB) IC9.16(INTA) JMP2.3 JP15.2 RN3.R4A(4A) RN4.R4A(4A)

## Notes on the sheet
- ADC/ANALOG SENSORS | DIGITAL SENSORS
- AMBIENT TEMP
- POWER LINE MEASUREMENT
- Voltage Measurement
  Typically:
  +48V (ROV Tether voltage. 55V tolerant)
  +12V (Motors/internal wiring. 55V tolerant)
  +5V (5V Tolerant)
  +3V3 (5V Tolerant)
- CURRENT | AMBIENT PRESSURE
- V. REF
- 3V Zener 
  Voltage Refrence
- GPIO CONTROLLERS
- 8 CHANNEL 10 BIT ADC x2
- VIN MGMT
- REVERSE
  POLARITY 
  PROTECTION
- +12V WILL NOT be at the 
  same potential as PWR_IN 
  due to voltage drop in Q1 
  and the fuse.
- Q1 Max current 
  = 35A
- Use 12V 3A+ Supply
- LED INDICATORS
- +5V BUCK REGULATOR
- PWM CONTROLLERS
- ADDRESS SELECTION
- I2C Address =
  0x1,A5,A4,A3,A2,A1,A1,RW
- CONNECTION HEADERS + 8 DIP SWITCH
- Open = 0 / Closed = 1
  'Open' choice marked with a dot on the board.
- ARDUINO
- ADDRESS SELECTION
- I2C Address =
  0x1,A5,A4,A3,A2,A1,A1,RW
- Open = 0 / Closed = 1
  'Open' choice marked with a dot on the board.
- Original Arduino Mini Design by Team Arduino
- Arduino Pro Mini Design by Spark Fun Electronics
- LEAK DETECT + PWR + GPIO #3
- AUX DEVICE POWER
- 40A Max per MOSFET.
  TO OBTAIN ANYTHING NEAR
  FULL CURRENT, TIN THE 
  TRACES ON THE BOARD!
- Emergency Telemetry: These should be
  used for important signals which need to be 
  constantly monitored.

## Library data of the parts
1-4 = microbuilder:MOUNTINGHOLE: Mounting Hole For #2 screws (0.086"/2.18mm width, 0.094"/2.4mm hole) use 2.5mm
5 = SparkFun:OSHW-LOGO: Open Source Hardware Logo This logo indicates the piece of hardware it is found on incorporates a OSHW license and/or adheres to the definition of open source hardware found here: http://freedomdefined.org/OSHW
C1 C2 = adafruit:CPOL-US: POLARIZED CAPACITOR, American symbol; OC_NEWARK: unknown
C3-C16 = microbuilder:CAP_CERAMIC: Ceramic Capacitors For new designs, use the packages preceded by an '_' character since they are more reliable: The following footprints should be used on most boards: _0402 - Standard footprint for regular board layouts _0603 - Standard footprint for regular board layouts _0805 - Standard footprint for regular board layouts _1206 - Standard footprint for regular board layouts For extremely tight-pitch boards where space is at a premium, the following 'micro-pitch' footprints can be used (smaller pads, no silkscreen outline, etc.): _0402MP - Micro-pitch footprint for very dense/compact boards _0603MP - Micro-pitch footprint for very dense/compact boards _0805MP - Micro-pitch footprint for very dense/compact boards _1206MP - Micro-pitch footprint for very dense/compact boards
C17 = rcl:C-EU: CAPACITOR, European symbol
D1 = diode:ZENER-DIODE: Z-Diode
F1 F3 = rev1_lbr:PTC_FUSE3
F2 = rev1_lbr:PTC_FUSE2
FID1-FID6 = microbuilder:FIDUCIAL: Fiducial Alignment Points Various fiducial points for machine vision alignment.
IC1-IC3 = rev1_lbr:MCP3008
IC4 IC5 = microchip:MCP23017: http://ww1.microchip.com/downloads/en/DeviceDoc/21952a.pdf Source: http://ww1.microchip.com/downloads/en/DeviceDoc/21952a.pdf; MF: MICROCHIP; MPN: MCP23017-E/ML; OC_FARNELL: unknown; OC_NEWARK: 31K2957
IC6 IC7 = microbuilder:PCA9685: PCA9685 - 16 Channel 12-Bit I2C PWM Controller 5.0V tolerant 16 channel, 12-bit I2C PWM controller with 25mA per output (max. 400mA total) Digikey: 568-5931-1-ND
IC8 = SparkFun-IC-Microcontroller:ATMEGA328P_VQFN: Atmel 328P QFN part not in catalog
IC9 = FIXED_328p_microchip:MCP23017: http://ww1.microchip.com/downloads/en/DeviceDoc/21952a.pdf Source: http://ww1.microchip.com/downloads/en/DeviceDoc/21952a.pdf; MF: MICROCHIP; MPN: MCP23017-E/ML; OC_FARNELL: unknown; OC_NEWARK: 31K2957
IC10 = rev1_lbr:LM62C: TI's Thermal Sensor LM62CIM3/NOPB
IC11 = VapeBoard:PRESSURE: Pressure Sensor MS563702BA03-50
IC12 IC13 = rev1_lbr:ACS781
JMP1-JMP23 = jump-or-no-paste:0R-JUMP: SMD 0R 0805 Jumper
JP1 JP2 = BETTERpinhead:PINHD-1X2: PIN HEADER
JP3 JP5 JP14 = BETTERpinhead:PINHD-1X4: PIN HEADER
JP4 = BETTERpinhead:PINHD-1X3: PIN HEADER
JP6 = pinhead:PINHD-2X20: PIN HEADER
JP7 JP9 = pinhead:PINHD-1X1: PIN HEADER
JP8 JP10-JP13 = pinhead:PINHD-2X8: PIN HEADER
JP15 = BETTERpinhead:PINHD-2X3: PIN HEADER
JP16 = pinhead:PINHD-2X5: PIN HEADER
LEAK1-LEAK8 = rev1_lbr:JST-GH-2
LED1-LED4 = eagle-ltspice:LED_E: LED Source: http://www.osram.convergy.de Source: www.luxeon.com Source: www.kingbright.com; SPICEMODEL: NONE; SPICEPREFIX: D; SPICETYPE: diode
PB1 = Switches:0173_IT-1185AP1C-160G-G_T&R: Pushbutton 4x3 SMD H2,5mm; MONTHLY_USAGE: _____; PART_NUMBER: IT-1185AP1C-160G-G_T&R; PRICE: _____; SUPPLIER: _____; TYPE: Switches; VALUE: 157SW
Q1 = rev1_lbr:1212_PFET: Vishay Siliconix Based on: SI7625DN-T1-GE3 ~35A P-channel MOSFET.
Q2-Q5 = rev1_lbr:1212_NFET: Vishay Siliconix Based on: SIS476DN-T1-GE3 ~40A N-channel MOSFET.
R1 R10-R26 = adafruit:R-US_: RESISTOR, American symbol
R2-R9 R27-R29 = resistor:R-US_: RESISTOR, American symbol
RN1-RN16 = rev1_lbr:RN4_0804
S1 = smd-special:SWS004: SMD Dip Switch 4 pol.
T1-T8 = transistor:*-PNP-: PNP Transistror
TP5-TP7 = testpad:PTR1: TEST PIN
X1-X7 = rev1_lbr:W237-102: WAGO SCREW CLAMP; MPN: 237-102; OC_FARNELL: unknown; OC_NEWARK: 70K9898
Y1 = Testing:RESONATOR: Resonator Small SMD resonator. This is the itty bitty 10/20MHz resonators with built in caps. CSTCE10M0G55 and CSTCE20M0V53. Footprint for SMD has been used in SFE production for years, and does work okay. 1:1 is an attempt to get larger fillets on the sides so it will be easier to inspect these solders in our AOI machine. The pads have been minimized to match the actual metal under the resonator. To see this relation, it includes an image import of the bottom side of the component. Imported to scale on layer 200.

## Net classes
0 default: width 0.203 mm
1 vcc: width 0.254 mm